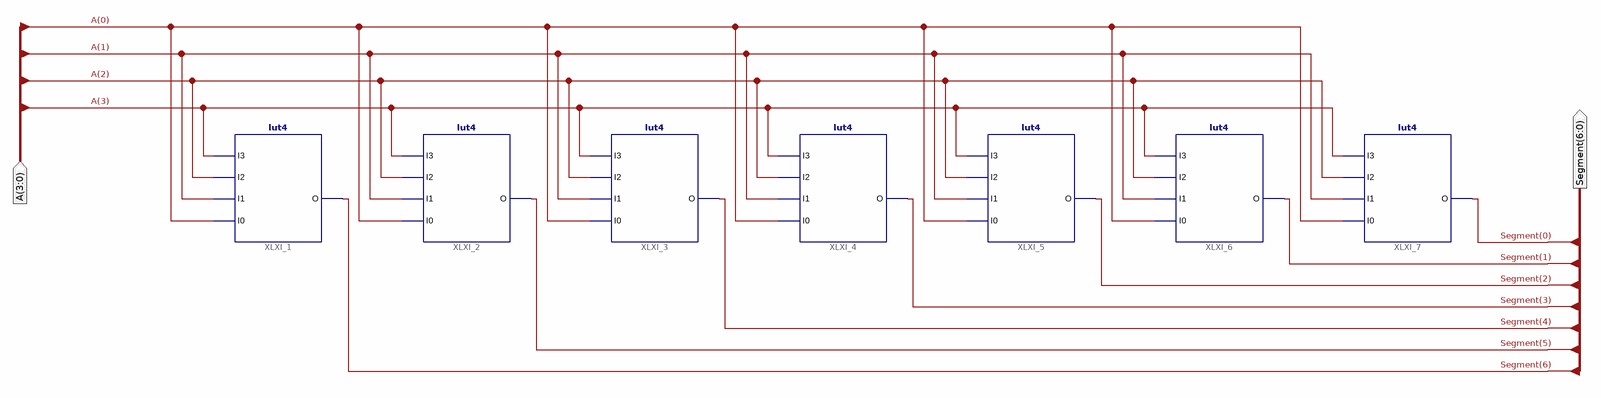
[diagram p0: schematic sheet 1]
// Xilinx ISE schematic ssd1d0ftb.sch (spartan6) as structural Verilog: 7 symbols, 2 ports
module ssd1d0ftb (
  input  [3:0] A,
  output [6:0] Segment
);

  lut4 #(.INIT("EF7C")) XLXI_1 (.I0(A[0]), .I1(A[1]), .I2(A[2]), .I3(A[3]), .O(Segment[6]));
  lut4 #(.INIT("DF71")) XLXI_2 (.I0(A[0]), .I1(A[1]), .I2(A[2]), .I3(A[3]), .O(Segment[5]));
  lut4 #(.INIT("FD45")) XLXI_3 (.I0(A[0]), .I1(A[1]), .I2(A[2]), .I3(A[3]), .O(Segment[4]));
  lut4 #(.INIT("7B6D")) XLXI_4 (.I0(A[0]), .I1(A[1]), .I2(A[2]), .I3(A[3]), .O(Segment[3]));
  lut4 #(.INIT("2FFB")) XLXI_5 (.I0(A[0]), .I1(A[1]), .I2(A[2]), .I3(A[3]), .O(Segment[2]));
  lut4 #(.INIT("279F")) XLXI_6 (.I0(A[0]), .I1(A[1]), .I2(A[2]), .I3(A[3]), .O(Segment[1]));
  lut4 #(.INIT("D7ED")) XLXI_7 (.I0(A[0]), .I1(A[1]), .I2(A[2]), .I3(A[3]), .O(Segment[0]));
endmodule
